# EAGLE schematic MCU (EAGLE 7.1.0)
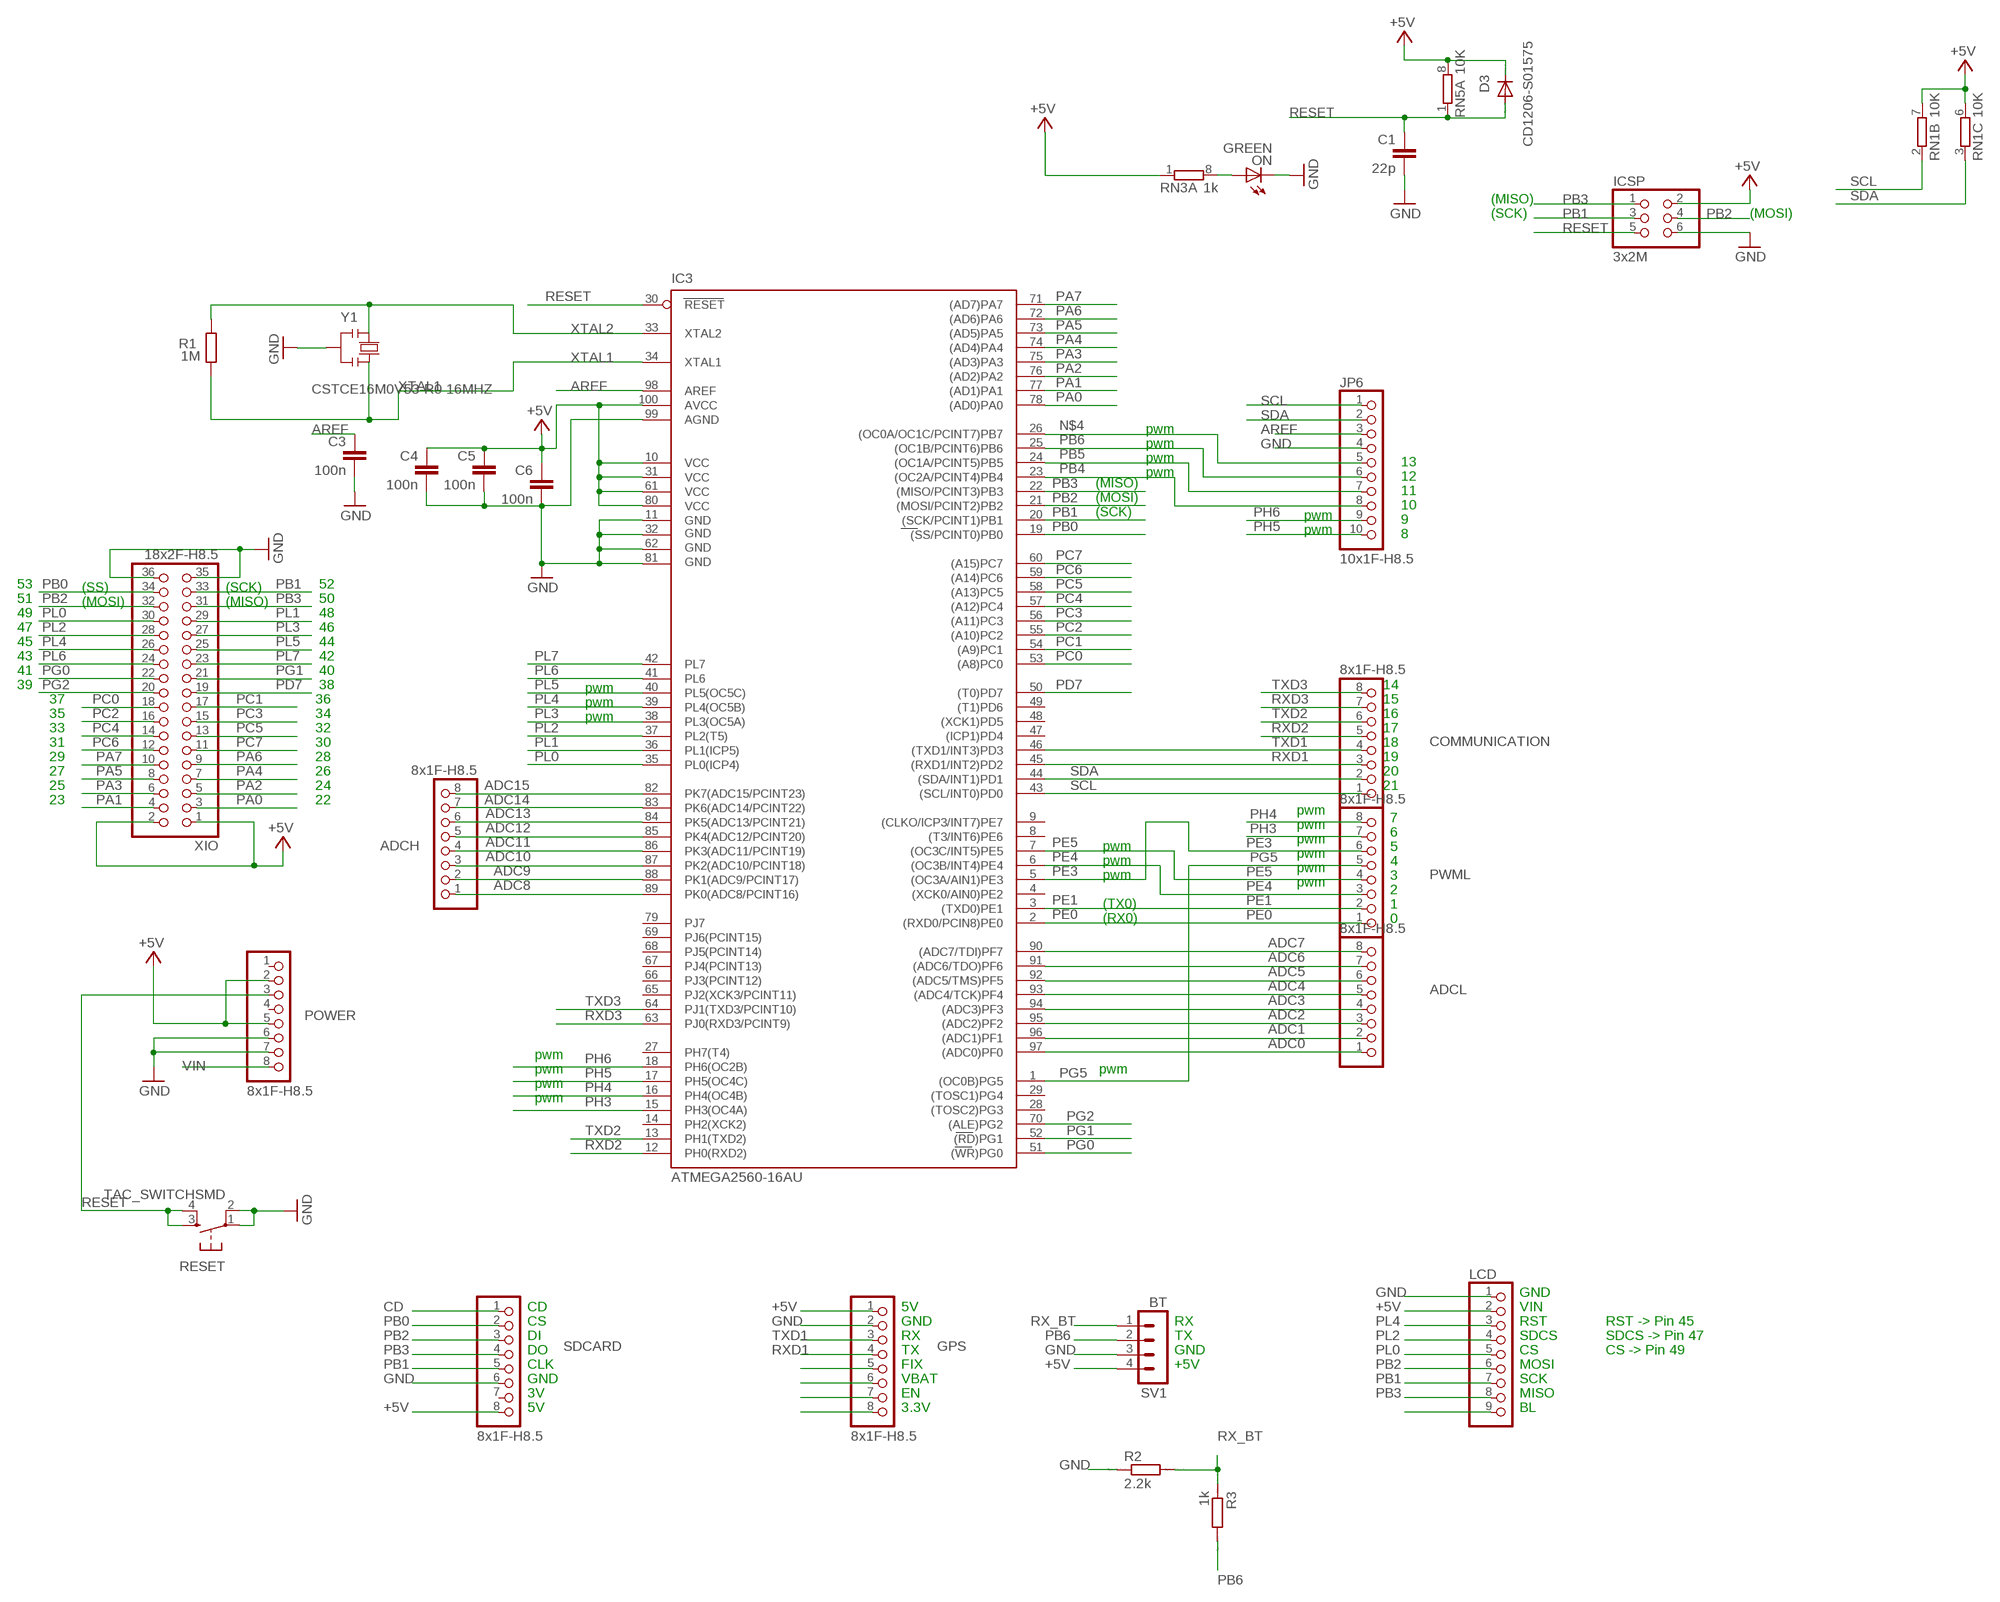
[diagram p0: schematic, sheet 1]

## Parts
ADCH  8x1F-H8.5  PINHD-1X8  [1X08]
ADCL  8x1F-H8.5  PINHD-1X8  [1X08]
C1  22p  C-EU0603-RND  [C0603-ROUND]
C3  100n  C-EU0603-RND  [C0603-ROUND]
C4  100n  C-EU0603-RND  [C0603-ROUND]
C5  100n  C-EU0603-RND  [C0603-ROUND]
C6  100n  C-EU0603-RND  [C0603-ROUND]
COMMUNICATION  8x1F-H8.5  PINHD-1X8  [1X08]
D3  CD1206-S01575  DIODE-MINIMELF  [MINIMELF]
GPS  8x1F-H8.5  PINHD-1X8  [1X08]
IC3  ATMEGA2560-16AU  ATMEGA25602560-16AU  [TQFP100]
ICSP  3x2M  PINHD-2X3  [2X03]
JP6  10x1F-H8.5  PINHD-1X10_ARD  [1X10]
LCD  PINHD-1X9  [1X09]
ON  GREEN  LEDCHIP-LED0805  [CHIP-LED0805]
POWER  8x1F-H8.5  PINHD-1X8  [1X08]
PWML  8x1F-H8.5  PINHD-1X8  [1X08]
R1  1M  R-EU_R0603  [R0603-ROUND]
R2  2.2k  R-EU_R0603  [R0603]
R3  1k  R-EU_R0603  [R0603]
RESET  TAC_SWITCHSMD  [TACTILE-SWITCH-SMD]
RN1  10K  4R-NCAT16  [CAT16]
RN3  1k  4R-NCAY16  [CAY16]
RN5  10K  4R-NCAT16  [CAT16]
SDCARD  8x1F-H8.5  PINHD-1X8  [1X08]
SV1  BT  MA04-1  [MA04-1]
XIO  18x2F-H8.5  PINHD-2X18  [2X18]
Y1  CSTCE16M0V53-R0 16MHZ  RESONATORMU  [RESONATOR]

## Nets
+5V [power usb]: C4.1 C5.1 C6.1 D3.C GPS.1 IC3.10(VCC) IC3.31(VCC1) IC3.61(VCC2) IC3.80(VCC3) IC3.100(AVCC) ICSP.2 LCD.2 POWER.2 POWER.5 RN1.6 RN1.7 RN3.1 RN5.8 SDCARD.8 SV1.4 XIO.1 XIO.2
ADC0: ADCL.1 IC3.97((ADC0)PF0)
ADC1: ADCL.2 IC3.96((ADC1)PF1)
ADC2: ADCL.3 IC3.95((ADC2)PF2)
ADC3: ADCL.4 IC3.94((ADC3)PF3)
ADC4: ADCL.5 IC3.93((ADC4/TCK)PF4)
ADC5: ADCL.6 IC3.92((ADC5/TMS)PF5)
ADC6: ADCL.7 IC3.91((ADC6/TDO)PF6)
ADC7: ADCL.8 IC3.90((ADC7/TDI)PF7)
ADC8: ADCH.1 IC3.89(PK0(ADC8/PCINT16))
ADC9: ADCH.2 IC3.88(PK1(ADC9/PCINT17))
ADC10: ADCH.3 IC3.87(PK2(ADC10/PCINT18))
ADC11: ADCH.4 IC3.86(PK3(ADC11/PCINT19))
ADC12: ADCH.5 IC3.85(PK4(ADC12/PCINT20))
ADC13: ADCH.6 IC3.84(PK5(ADC13/PCINT21))
ADC14: ADCH.7 IC3.83(PK6(ADC14/PCINT22))
ADC15: ADCH.8 IC3.82(PK7(ADC15/PCINT23))
AREF: C3.1 IC3.98(AREF) JP6.3
CD: SDCARD.1
GND [gnd]: C1.2 C3.2 C4.2 C5.2 C6.2 GPS.2 IC3.11(GND) IC3.32(GND1) IC3.62(GND2) IC3.81(GND3) IC3.99(AGND) ICSP.6 JP6.4 LCD.1 ON.C POWER.6 POWER.7 R2.1 RESET.1 RESET.2 SDCARD.6 SV1.3 XIO.35 XIO.36 Y1.2
N$3: ON.A RN3.8
N$4: IC3.26((OC0A/OC1C/PCINT7)PB7) JP6.5
N$9: GPS.5
N$10: GPS.6
N$11: GPS.7
N$12: GPS.8
N$15: LCD.9
PA0: IC3.78((AD0)PA0) XIO.3
PA1: IC3.77((AD1)PA1) XIO.4
PA2: IC3.76((AD2)PA2) XIO.5
PA3: IC3.75((AD3)PA3) XIO.6
PA4: IC3.74((AD4)PA4) XIO.7
PA5: IC3.73((AD5)PA5) XIO.8
PA6: IC3.72((AD6)PA6) XIO.9
PA7: IC3.71((AD7)PA7) XIO.10
PB0: IC3.19((SS/PCINT0)PB0) SDCARD.2 XIO.34
PB1: IC3.20((SCK/PCINT1)PB1) ICSP.3 LCD.7 SDCARD.5 XIO.33
PB2: IC3.21((MOSI/PCINT2)PB2) ICSP.4 LCD.6 SDCARD.3 XIO.32
PB3: IC3.22((MISO/PCINT3)PB3) ICSP.1 LCD.8 SDCARD.4 XIO.31
PB4: IC3.23((OC2A/PCINT4)PB4) JP6.8
PB5: IC3.24((OC1A/PCINT5)PB5) JP6.7
PB6: IC3.25((OC1B/PCINT6)PB6) JP6.6 R3.2 SV1.2
PC0: IC3.53((A8)PC0) XIO.18
PC1: IC3.54((A9)PC1) XIO.17
PC2: IC3.55((A10)PC2) XIO.16
PC3: IC3.56((A11)PC3) XIO.15
PC4: IC3.57((A12)PC4) XIO.14
PC5: IC3.58((A13)PC5) XIO.13
PC6: IC3.59((A14)PC6) XIO.12
PC7: IC3.60((A15)PC7) XIO.11
PD7: IC3.50((T0)PD7) XIO.19
PE0: IC3.2((RXD0/PCIN8)PE0) PWML.1
PE1: IC3.3((TXD0)PE1) PWML.2
PE3: IC3.5((OC3A/AIN1)PE3) PWML.6
PE4: IC3.6((OC3B/INT4)PE4) PWML.3
PE5: IC3.7((OC3C/INT5)PE5) PWML.4
PG0: IC3.51((WR)PG0) XIO.22
PG1: IC3.52((RD)PG1) XIO.21
PG2: IC3.70((ALE)PG2) XIO.20
PG5: IC3.1((OC0B)PG5) PWML.5
PH3: IC3.15(PH3(OC4A)) PWML.7
PH4: IC3.16(PH4(OC4B)) PWML.8
PH5: IC3.17(PH5(OC4C)) JP6.10
PH6: IC3.18(PH6(OC2B)) JP6.9
PL0: IC3.35(PL0(ICP4)) LCD.5 XIO.30
PL1: IC3.36(PL1(ICP5)) XIO.29
PL2: IC3.37(PL2(T5)) LCD.4 XIO.28
PL3: IC3.38(PL3(OC5A)) XIO.27
PL4: IC3.39(PL4(OC5B)) LCD.3 XIO.26
PL5: IC3.40(PL5(OC5C)) XIO.25
PL6: IC3.41(PL6) XIO.24
PL7: IC3.42(PL7) XIO.23
RESET: C1.1 D3.A IC3.30(RESET) ICSP.5 POWER.3 RESET.3 RESET.4 RN5.1
RX_BT: R2.2 R3.1 SV1.1
RXD1: COMMUNICATION.3 GPS.4 IC3.45((RXD1/INT2)PD2)
RXD2: COMMUNICATION.5 IC3.12(PH0(RXD2))
RXD3: COMMUNICATION.7 IC3.63(PJ0(RXD3/PCINT9))
SCL: COMMUNICATION.1 IC3.43((SCL/INT0)PD0) JP6.1 RN1.2
SDA: COMMUNICATION.2 IC3.44((SDA/INT1)PD1) JP6.2 RN1.3
TXD1: COMMUNICATION.4 GPS.3 IC3.46((TXD1/INT3)PD3)
TXD2: COMMUNICATION.6 IC3.13(PH1(TXD2))
TXD3: COMMUNICATION.8 IC3.64(PJ1(TXD3/PCINT10))
VIN [power]: POWER.8
XTAL1: IC3.34(XTAL1) R1.1 Y1.3
XTAL2: IC3.33(XTAL2) R1.2 Y1.1
Unconnected: IC3.4((XCK0/AIN0)PE2) IC3.8((T3/INT6)PE6) IC3.9((CLKO/ICP3/INT7)PE7) IC3.14(PH2(XCK2)) IC3.27(PH7(T4)) IC3.28((TOSC2)PG3) IC3.29((TOSC1)PG4) IC3.47((ICP1)PD4) IC3.48((XCK1)PD5) IC3.49((T1)PD6) IC3.65(PJ2(XCK3/PCINT11)) IC3.66(PJ3(PCINT12)) IC3.67(PJ4(PCINT13)) IC3.68(PJ5(PCINT14)) IC3.69(PJ6(PCINT15)) IC3.79(PJ7) POWER.1 POWER.4 RN1.1 RN1.4 RN1.5 RN1.8 RN3.2 RN3.3 RN3.4 RN3.5 RN3.6 RN3.7 RN5.2 RN5.3 RN5.4 RN5.5 RN5.6 RN5.7 SDCARD.7

## Notes on the sheet
- (MISO)
- (SCK) | (MOSI)
- pwm
- pwm
- pwm | 13
- pwm | 12
- (MISO)
- 11
- (MOSI)
- 10
- (SCK) | pwm
- 9
- pwm | 8
- 53 | (SS) | (SCK) | 52
- 51 | (MOSI) | (MISO) | 50
- 49 | 48
- 47 | 46
- 45 | 44
- 43 | 42
- 41 | 40
- 39 | 38 | pwm | 14
- 37 | 36 | pwm | 15
- 35 | 34 | pwm | 16
- 33 | 32 | 17
- 31 | 30 | 18
- 29 | 28 | 19
- 27 | 26 | 20
- 25 | 24 | 21
- 23 | 22
- pwm
- 7
- pwm
- 6
- pwm
- pwm | 5
- pwm
- pwm | 4
- pwm
- pwm | 3
- pwm
- 2
- (TX0) | 1
- (RX0) | 0
- pwm
- pwm | pwm
- pwm
- pwm
- GND
- CD | 5V | VIN
- CS | GND | RX | RST | RST -> Pin 45
- DI | RX | TX | SDCS | SDCS -> Pin 47
- DO | TX | GND | CS | CS -> Pin 49
- CLK | FIX | +5V | MOSI
- GND | VBAT | SCK
- 3V | EN | MISO
- 5V | 3.3V | BL

## Library data of the parts
ADCH ADCL COMMUNICATION GPS POWER PWML SDCARD = SmartPrj:PINHD-1X8: PIN HEADER
C1 C3-C6 = SmartPrj:C-EU: CAPACITOR, European symbol
D3 = diode:DIODE-: DIODE
IC3 = SmartPrj:ATMEGA2560: MICROCONTROLLER 64/128/256 Kbytes FLASH 4 Kbytes EEPROM 8 Kbytes SRAM 86 General Purpose I/O pins 12-channels16-bit PWM 4 x Serial USARTs 16-channels 10-bit A/D
ICSP = SmartPrj:PINHD-2X3: PIN HEADER
JP6 = SmartPrj:PINHD-1X10_ARD: PIN HEADER
LCD = pinhead:PINHD-1X9: PIN HEADER
ON = led:LED: LED OSRAM: - CHIPLED LG R971, LG N971, LY N971, LG Q971, LY Q971, LO R971, LY R971 LH N974, LH R974 LS Q976, LO Q976, LY Q976 LO Q996 - Hyper CHIPLED LW Q18S LB Q993, LB Q99A, LB R99A - SideLED LS A670, LO A670, LY A670, LG A670, LP A670 LB A673, LV A673, LT A673, LW A673 LH A674 LY A675 LS A676, LA A676, LO A676, LY A676, LW A676 LS A679, LY A679, LG A679 - Hyper Micro SIDELED® LS Y876, LA Y876, LO Y876, LY Y876 LT Y87S - SmartLED LW L88C, LW L88S LB L89C, LB L89S, LG L890 LS L89K, LO L89K, LY L89K LS L896, LA L896, LO L896, LY L896 - TOPLED LS T670, LO T670, LY T670, LG T670, LP T670 LSG T670, LSP T670, LSY T670, LOP T670, LYG T670 LG T671, LOG T671, LSG T671 LB T673, LV T673, LT T673, LW T673 LH T674 LS T676, LA T676, LO T676, LY T676, LB T676, LH T676, LSB T676, LW T676 LB T67C, LV T67C, LT T67C, LS T67K, LO T67K, LY T67K, LW E67C LS E67B, LA E67B, LO E67B, LY E67B, LB E67C, LV E67C, LT E67C LW T67C LS T679, LY T679, LG T679 LS T770, LO T770, LY T770, LG T770, LP T770 LB T773, LV T773, LT T773, LW T773 LH T774 LS E675, LA E675, LY E675, LS T675 LS T776, LA T776, LO T776, LY T776, LB T776 LHGB T686 LT T68C, LB T68C - Hyper Mini TOPLED® LB M676 - Mini TOPLED Santana® LG M470 LS M47K, LO M47K, LY M47K Source: http://www.osram.convergy.de LUXEON: - LUMILED® LXK2-PW12-R00, LXK2-PW12-S00, LXK2-PW14-U00, LXK2-PW14-V00 LXK2-PM12-R00, LXK2-PM12-S00, LXK2-PM14-U00 LXK2-PE12-Q00, LXK2-PE12-R00, LXK2-PE12-S00, LXK2-PE14-T00, LXK2-PE14-U00 LXK2-PB12-K00, LXK2-PB12-L00, LXK2-PB12-M00, LXK2-PB14-N00, LXK2-PB14-P00, LXK2-PB14-Q00 LXK2-PR12-L00, LXK2-PR12-M00, LXK2-PR14-Q00, LXK2-PR14-R00 LXK2-PD12-Q00, LXK2-PD12-R00, LXK2-PD12-S00 LXK2-PH12-R00, LXK2-PH12-S00 LXK2-PL12-P00, LXK2-PL12-Q00, LXK2-PL12-R00 Source: www.luxeon.com KINGBRIGHT: KA-3528ASYC Source: www.kingbright.com
R1 = SmartPrj:R-EU_: RESISTOR, European symbol
R2 R3 = resistor:R-EU_: RESISTOR, European symbol; SPICEPREFIX: R
RESET = SparkFun-Retired:TAC_SWITCH: Momentary Switch Button commonly used for reset or general input. Spark Fun Electronics SKU : COM-00097 SMT- SWCH-08247; PROD_ID: SWCH-08247
RN1 RN3 RN5 = resistor-dil:4R-N: Array Chip Resistor Source: RS Component / Phycomp; OC_FARNELL: unknown; OC_NEWARK: unknown
SV1 = con-lstb:MA04-1: PIN HEADER; OC_FARNELL: unknown; OC_NEWARK: unknown
XIO = SmartPrj:PINHD-2X18: PIN HEADER
Y1 = SmartPrj:RESONATOR

## Net classes
0 default: width 0.203 mm, drill 0.406 mm, clearance 0.203 mm
1 power: width 0.61 mm, drill 0.406 mm, clearance 0.203 mm
2 gnd: width 0.305 mm, drill 0.406 mm, clearance 0.203 mm
3 power usb: width 0.508 mm, drill 0.406 mm, clearance 0.203 mm